# Altium schematic sheet BalEv_STM_v1_0.SchDoc
size A4; CompanyName: HESSO; Address1: Route du Rawyl 47; Address2: 1950 Sion; Address3: Switzerland; DocumentNumber: 3; SheetNumber: 2; SheetTotal: 9; PageSetup: Record=PageOptions|CenterHorizontal=True|CenterVertical=True|PrintScale=1.00|XCorrection=1.00|YCorrection=1.00|PrintKind=1|BorderSize=5000000|LeftOffset=0|BottomOffset=0|Orientation=2|PaperLength=1000|PaperWidth=1000|Scale=100|PaperSource=15|PrintQuality=1200|MediaType=1|DitherType=10|PrintScaleMode=1|PaperKind=A4|PaperIndex=9; ProjectName: Project Name
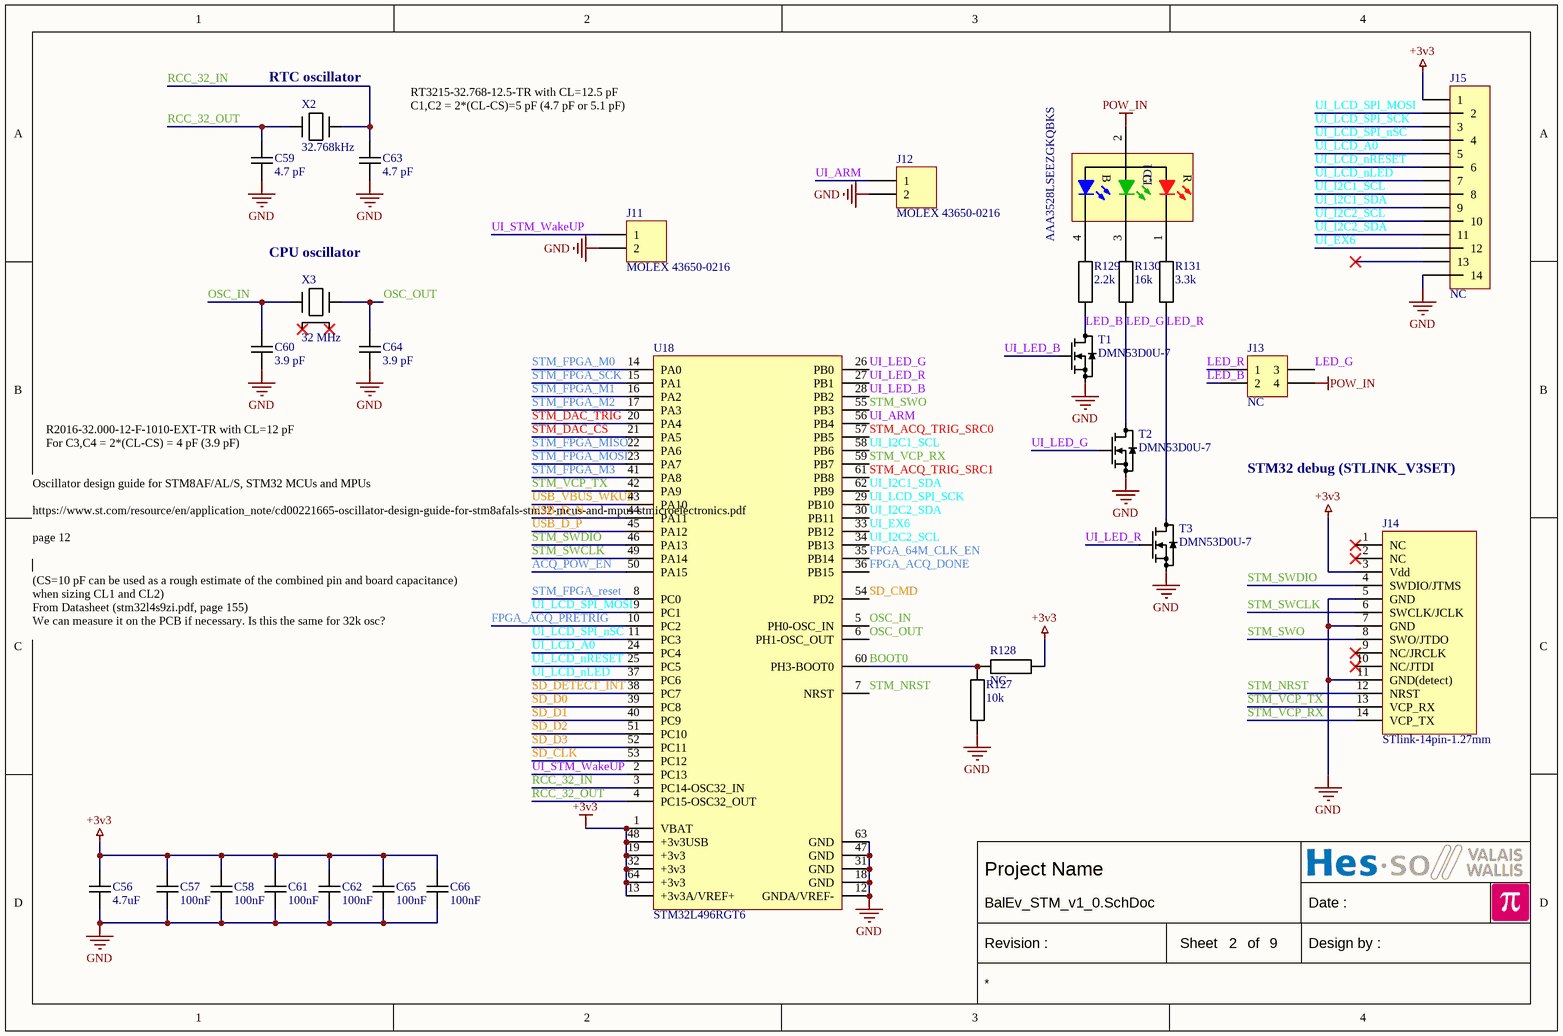
[diagram p0: BalEv_STM_v1_0.SchDoc]

## Parts
C56  4.7uF  [CAPACITOR 1005 REFLOW]
C57  100nF  [CAPACITOR 1005 REFLOW]
C58  100nF  [CAPACITOR 1005 REFLOW]
C59  4.7 pF  [CAPACITOR 1005 REFLOW]
C60  3.9 pF  [CAPACITOR 1005 REFLOW]
C61  100nF  [CAPACITOR 1005 REFLOW]
C62  100nF  [CAPACITOR 1005 REFLOW]
C63  4.7 pF  [CAPACITOR 1005 REFLOW]
C64  3.9 pF  [CAPACITOR 1005 REFLOW]
C65  100nF  [CAPACITOR 1005 REFLOW]
C66  100nF  [CAPACITOR 1005 REFLOW]
J11  MOLEX 43650-0216  [MOLEX 43650-0216]
J12  MOLEX 43650-0216  [MOLEX 43650-0216]
J13  NC  [MOLEX 43045-0412]
J14  STlink-14pin-1.27mm  [SHF-107-01-X-X-TH]
J15  NC  [FlatCable2x7 2MM Straight TH FCI 98414-G06-14ULF]
LD1  AAA3528LSEEZGKQBKS  [LED Kingbright AAA3528LSEEZGKQBKS]
R127  10k  [RESISTOR 1005 REFLOW]
R128  NC  [RESISTOR 1005 REFLOW]
R129  2.2k  [RESISTOR 1005 REFLOW]
R130  16k  [RESISTOR 1005 REFLOW]
R131  3.3k  [RESISTOR 1005 REFLOW]
T1  DMN53D0U-7  [SOT23 P0.95 C1.6x3.0 H1.3]
T2  DMN53D0U-7  [SOT23 P0.95 C1.6x3.0 H1.3]
T3  DMN53D0U-7  [SOT23 P0.95 C1.6x3.0 H1.3]
U18  STM32L496RGT6  [LQFP64 P0.5 C10.0x10.0 H1.6]
X2  32.768kHz  [Crystal C3.2x1.5 Abracon ABS07]
X3  32 MHz  [Crystal C2.0x1.6 Abracon ABM11W]

## Nets
+3v3: C56.2 C57.2 C58.2 C61.2 C62.2 C65.2 C66.2 J14.3(Vdd) J15.1 R128.1 U18.1(VBAT) U18.13(+3v3A/VREF+) U18.19(+3v3) U18.32(+3v3) U18.48(+3v3USB) U18.64(+3v3)
GND: C56.1 C57.1 C58.1 C59.1 C60.1 C61.1 C62.1 C63.1 C64.1 C65.1 C66.1 J11.2 J12.2 J14.5(GND) J14.7(GND) J14.11(GND(detect)) J15.14 R127.2 T1.2(S) T2.2(S) T3.2(S) U18.12(GNDA/VREF-) U18.18(GND) U18.31(GND) U18.47(GND) U18.63(GND)
POW_IN: J13.4 LD1.2(A)
ACQ_POW_EN: U18.50(PA15)
BOOT0: R127.1 R128.2 U18.60(PH3-BOOT0)
FPGA_64M_CLK_EN: U18.35(PB14)
FPGA_ACQ_DONE: U18.36(PB15)
FPGA_ACQ_PRETRIG: U18.10(PC2)
LED_B: J13.2 R129.2 T1.3(D)
LED_G: J13.3 R130.2 T2.3(D)
LED_R: J13.1 R131.2 T3.3(D)
OSC_IN: C60.2 U18.5(PH0-OSC_IN) X3.1
OSC_OUT: C64.2 U18.6(PH1-OSC_OUT) X3.3
RCC_32_IN: C63.2 U18.3(PC14-OSC32_IN) X2.2
RCC_32_OUT: C59.2 U18.4(PC15-OSC32_OUT) X2.1
SD_CLK: U18.53(PC12)
SD_CMD: U18.54(PD2)
SD_D0: U18.39(PC8)
SD_D1: U18.40(PC9)
SD_D2: U18.51(PC10)
SD_D3: U18.52(PC11)
SD_DETECT_INT: U18.38(PC7)
STM_ACQ_TRIG_SRC0: U18.57(PB5)
STM_ACQ_TRIG_SRC1: U18.61(PB8)
STM_DAC_CS: U18.21(PA5)
STM_DAC_TRIG: U18.20(PA4)
STM_FPGA_M0: U18.14(PA0)
STM_FPGA_M1: U18.16(PA2)
STM_FPGA_M2: U18.17(PA3)
STM_FPGA_M3: U18.41(PA8)
STM_FPGA_MISO: U18.22(PA6)
STM_FPGA_MOSI: U18.23(PA7)
STM_FPGA_reset: U18.8(PC0)
STM_FPGA_SCK: U18.15(PA1)
STM_NRST: J14.12(NRST) U18.7(NRST)
STM_SWCLK: J14.6(SWCLK/JCLK) U18.49(PA14)
STM_SWDIO: J14.4(SWDIO/JTMS) U18.46(PA13)
STM_SWO: J14.8(SWO/JTDO) U18.55(PB3)
STM_VCP_RX: J14.14(VCP_TX) U18.59(PB7)
STM_VCP_TX: J14.13(VCP_RX) U18.42(PA9)
UI_ARM: J12.1 U18.56(PB4)
UI_EX6: J15.12 U18.33(PB12)
UI_I2C1_SCL: J15.8 U18.58(PB6)
UI_I2C1_SDA: J15.9 U18.62(PB9)
UI_I2C2_SCL: J15.10 U18.34(PB13)
UI_I2C2_SDA: J15.11 U18.30(PB11)
UI_LCD_A0: J15.5 U18.24(PC4)
UI_LCD_nLED: J15.7 U18.37(PC6)
UI_LCD_nRESET: J15.6 U18.25(PC5)
UI_LCD_SPI_MOSI: J15.2 U18.9(PC1)
UI_LCD_SPI_nSC: J15.4 U18.11(PC3)
UI_LCD_SPI_SCK: J15.3 U18.29(PB10)
UI_LED_B: T1.1(G) U18.28(PB2)
UI_LED_G: T2.1(G) U18.26(PB0)
UI_LED_R: T3.1(G) U18.27(PB1)
UI_STM_WakeUP: J11.1 U18.2(PC13)
USB_D_N: U18.44(PA11)
USB_D_P: U18.45(PA12)
USB_VBUS_WKUP: U18.43(PA10)
NetLD1_1: LD1.1(R) R131.1
NetLD1_3: LD1.3(G) R130.1
NetLD1_4: LD1.4(B) R129.1

Not connected (* = marked no-connect by the designer): J14 1(NC)* 2(NC)* 9(NC/JRCLK)* 10(NC/JTDI)*; J15 13*; X3 2* 4*

## Notes on the sheet
- (near X2) RTC oscillator
- (near C63) RT3215-32.768-12.5-TR with CL=12.5 pF
  C1,C2 = 2*(CL-CS)=5 pF (4.7 pF or 5.1 pF)
- (near X3) CPU oscillator
- R2016-32.000-12-F-1010-EXT-TR with CL=12 pF
  For C3,C4 = 2*(CL-CS) = 4 pF (3.9 pF)
- STM32 debug (STLINK_V3SET)
- Oscillator design guide for STM8AF/AL/S, STM32 MCUs and MPUs
  https://www.st.com/resource/en/application_note/cd00221665-oscillator-design-guide-for-stm8afals-stm32-mcus-and-mpus-stmicroelectronics.pdf
  page 12
- (CS=10 pF can be used as a rough estimate of the combined pin and board capacitance) when sizing CL1 and CL2)
  From Datasheet (stm32l4s9zi.pdf, page 155)
  We can measure it on the PCB if necessary. Is this the same for 32k osc?
- Date :
- Revision :
- Sheet
- of
- Design by :

## Library data of the parts
C56-C66 = Capacitor: STOCK: NO
  C56: Value: 4.7uF
  C57 C58 C61 C62 C65 C66: Value: 100nF
  C59 C63: Value: 4.7 pF
  C60 C64: Value: 3.9 pF
J11 J12 = MOLEX 43650-0216: Micro-Fit 3.0 Vertical Header, 3.00mm Pitch, Single Row, 2 Circuits
J13 = MOLEX 43045-0412
J15 = FlatCable2x7
LD1 = LED Kingbright AAA3528LSEEZGKQBKS: 3.5x2.8mm SURFACE MOUNT LED LAMP; Value: AAA3528LSEEZGKQBKS
R127-R131 = Resistor: STOCK: NO
  R127: Value: 10k
  R128: Value: NC
  R129: Value: 2.2k
  R130: Value: 16k
  R131: Value: 3.3k
T1-T3 = MOS-N SOT23 G-S-D: Generic MOS-N; Value: DMN53D0U-7
U18 = STM32L4X6R_T: Ultra-low-power Arm® Cortex®-M4 32-bit MCU+FPU, 100DMIPS, / up to 1MB Flash, 320KB SRAM, USB OTG FS, audio, ext. SMPS; Value: STM32L496RGT6
X2 = Crystal C3.2x1.5 Abracon ABS07: RT3215-32.768-12.5-TR; Value: 32.768kHz; STOCK: YES
X3 = Crystal C2.0x1.6 Abracon ABM11W: R2016-32.000-12-F-1010-EXT-TR; Value: 32 MHz; STOCK: YES